# Altium schematic sheet 02-MCU.SchDoc
size A
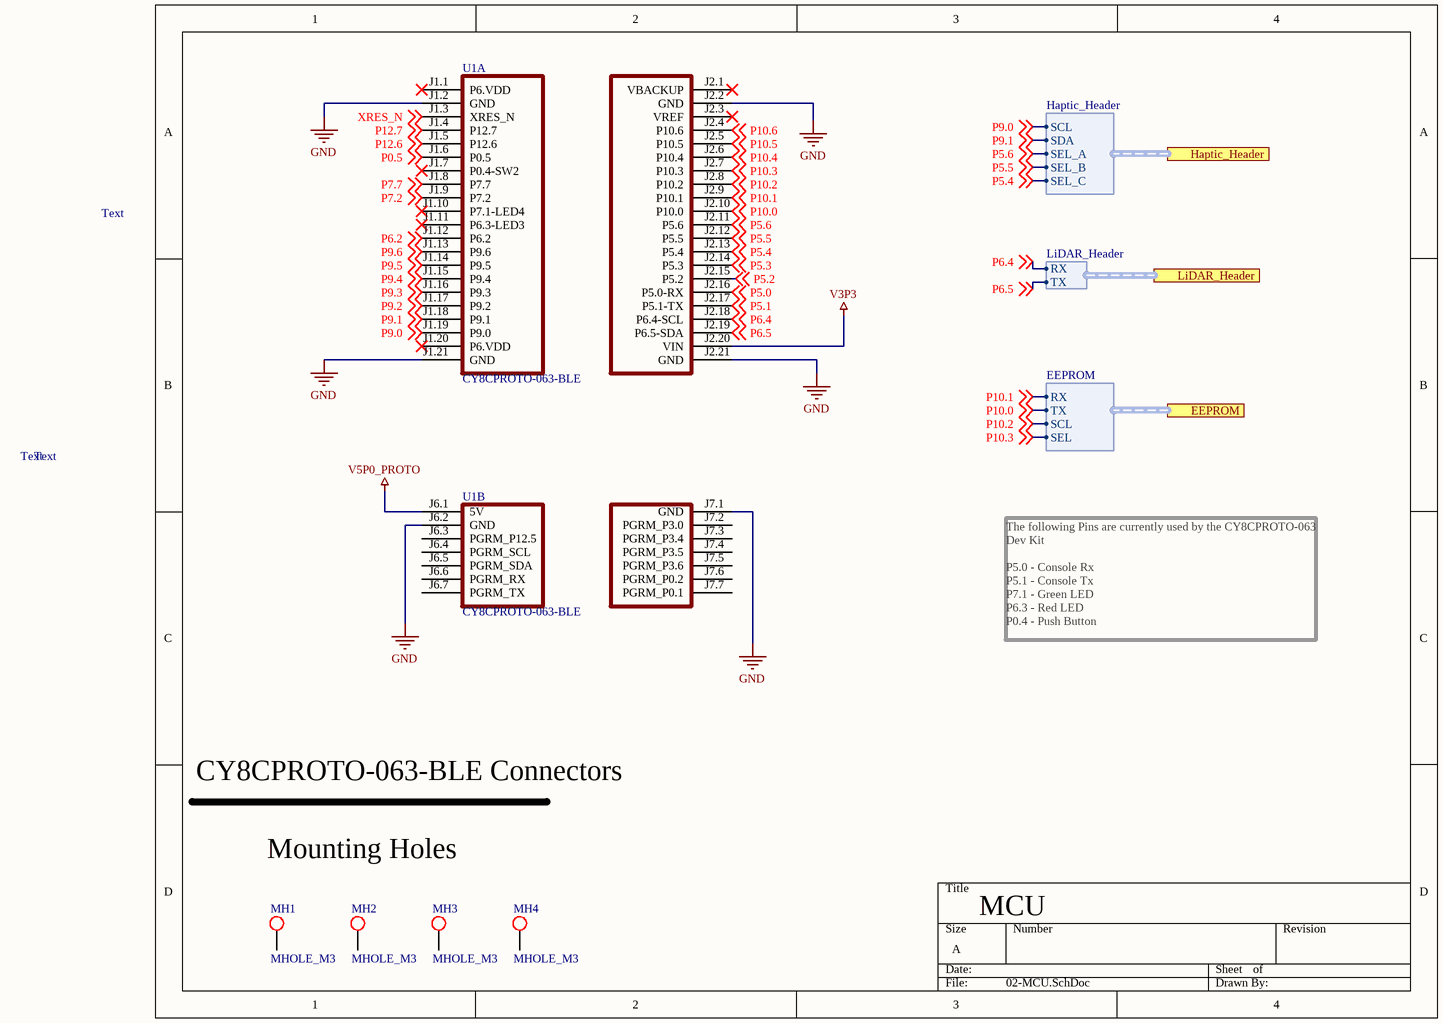
[diagram p0: 02-MCU.SchDoc]

## Parts
MH1  MHOLE_M3  [MHOLE_M3]  (no BOM)
MH2  MHOLE_M3  [MHOLE_M3]  (no BOM)
MH3  MHOLE_M3  [MHOLE_M3]  (no BOM)
MH4  MHOLE_M3  [MHOLE_M3]  (no BOM)
U1  CY8CPROTO-063-BLE  [CY8CPROTO-063-BLE]  (parts A,B of 2)  (no BOM)

## Ports
EEPROM (harness EEPROM), Haptic_Header (harness Haptic_Header), LiDAR_Header (harness LiDAR_Header)

## Harnesses
Haptic_Header: SCL, SDA, SEL_A, SEL_B, SEL_C
LiDAR_Header: RX, TX
EEPROM: RX, TX, SCL, SEL

## Nets
GND: U1.J1.2(GND) U1.J1.21(GND) U1.J2.2(GND) U1.J2.21(GND) U1.J6.2(GND) U1.J7.1(GND)
V3P3: U1.J2.20(VIN)
V5P0_PROTO: U1.J6.1(5V)
P0.5: U1.J1.6(P0.5) ; off-sheet P0.5
P5.0: U1.J2.16(P5.0-RX) ; off-sheet P5.0
P5.1: U1.J2.17(P5.1-TX) ; off-sheet P5.1
P5.2: U1.J2.15(P5.2) ; off-sheet P5.2
P5.3: U1.J2.14(P5.3) ; off-sheet P5.3
P5.4: U1.J2.13(P5.4) ; off-sheet P5.4, port Haptic_Header.SEL_C
P5.5: U1.J2.12(P5.5) ; off-sheet P5.5, port Haptic_Header.SEL_B
P5.6: U1.J2.11(P5.6) ; off-sheet P5.6, port Haptic_Header.SEL_A
P6.2: U1.J1.12(P6.2) ; off-sheet P6.2
P6.4: U1.J2.18(P6.4-SCL) ; off-sheet P6.4, port LiDAR_Header.RX
P6.5: U1.J2.19(P6.5-SDA) ; off-sheet P6.5, port LiDAR_Header.TX
P7.2: U1.J1.9(P7.2) ; off-sheet P7.2
P7.7: U1.J1.8(P7.7) ; off-sheet P7.7
P9.0: U1.J1.19(P9.0) ; off-sheet P9.0, port Haptic_Header.SCL
P9.1: U1.J1.18(P9.1) ; off-sheet P9.1, port Haptic_Header.SDA
P9.2: U1.J1.17(P9.2) ; off-sheet P9.2
P9.3: U1.J1.16(P9.3) ; off-sheet P9.3
P9.4: U1.J1.15(P9.4) ; off-sheet P9.4
P9.5: U1.J1.14(P9.5) ; off-sheet P9.5
P9.6: U1.J1.13(P9.6) ; off-sheet P9.6
P10.0: U1.J2.10(P10.0) ; off-sheet P10.0, port EEPROM.TX
P10.1: U1.J2.9(P10.1) ; off-sheet P10.1, port EEPROM.RX
P10.2: U1.J2.8(P10.2) ; off-sheet P10.2, port EEPROM.SCL
P10.3: U1.J2.7(P10.3) ; off-sheet P10.3, port EEPROM.SEL
P10.4: U1.J2.6(P10.4) ; off-sheet P10.4
P10.5: U1.J2.5(P10.5) ; off-sheet P10.5
P10.6: U1.J2.4(P10.6) ; off-sheet P10.6
P12.6: U1.J1.5(P12.6) ; off-sheet P12.6
P12.7: U1.J1.4(P12.7) ; off-sheet P12.7
XRES_N: U1.J1.3(XRES_N) ; off-sheet XRES_N

Not connected (* = marked no-connect by the designer): MH1 1; MH2 1; MH3 1; MH4 1; U1 J1.1(P6.VDD)* J1.7(P0.4-SW2)* J1.10(P7.1-LED4)* J1.11(P6.3-LED3)* J1.20(P6.VDD)* J2.1(VBACKUP)* J2.3(VREF)* J6.3(PGRM_P12.5) J6.4(PGRM_SCL) J6.5(PGRM_SDA) J6.6(PGRM_RX) J6.7(PGRM_TX) J7.2(PGRM_P3.0) J7.3(PGRM_P3.4) J7.4(PGRM_P3.5) J7.5(PGRM_P3.6) J7.6(PGRM_P0.2) J7.7(PGRM_P0.1)

## Notes on the sheet
- Text
- The following Pins are currently used by the CY8CPROTO-063 Dev Kit
  P5.0 - Console Rx
  P5.1 - Console Tx
  P7.1 - Green LED
  P6.3 - Red LED
  P0.4 - Push Button
- CY8CPROTO-063-BLE Connectors
- Mounting Holes
- MCU

## Library data of the parts
MH1-MH4 = MHOLE_M3: Mounting Hole - M3 Metric
U1 = IC_CY8CPROTO-063-BLE